# EAGLE schematic MicrophoneSoundModule (EAGLE 6.4)
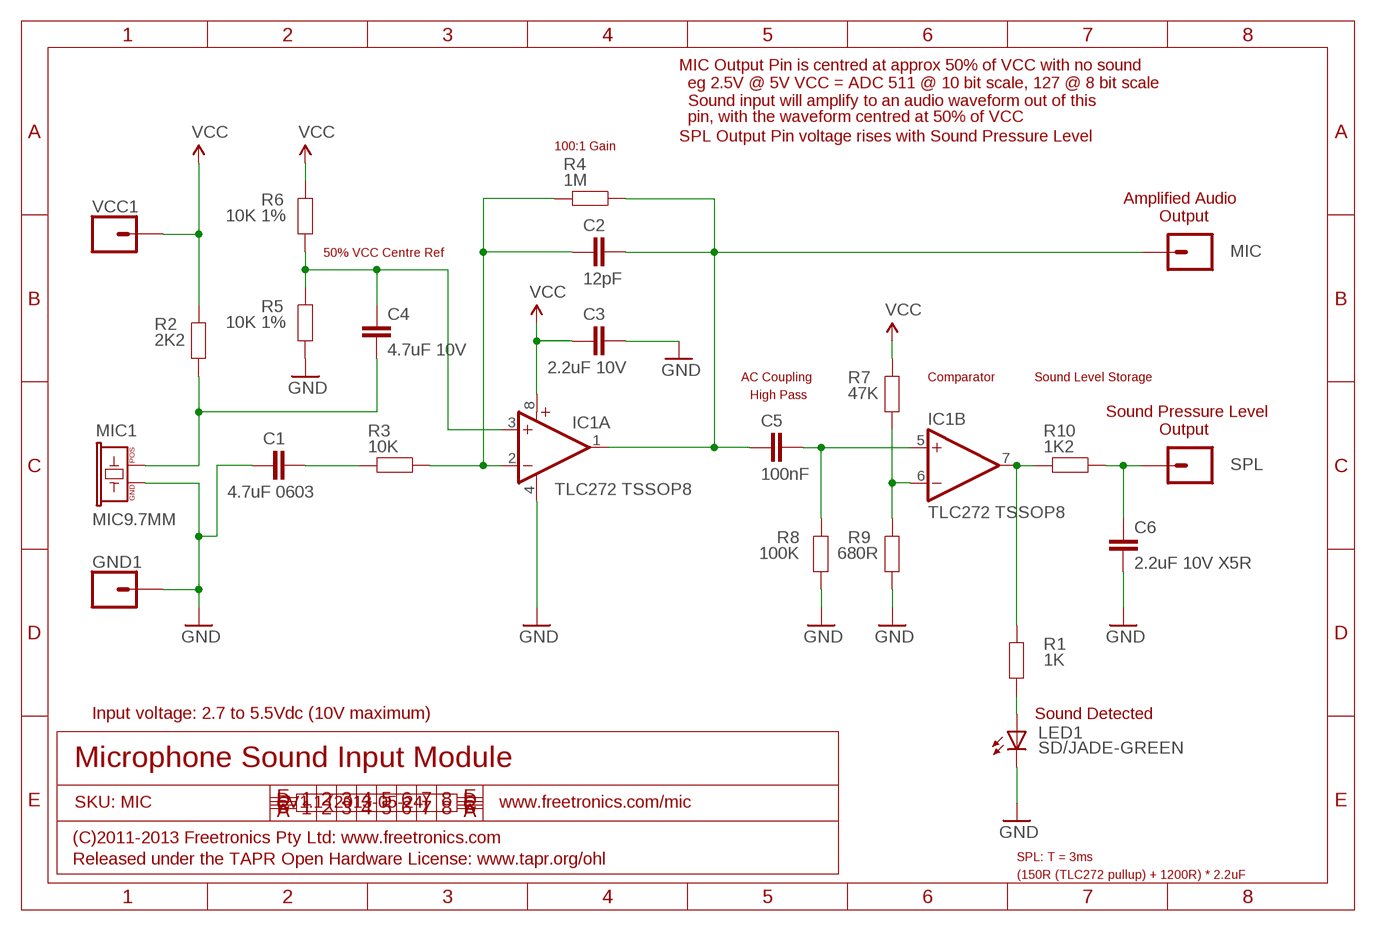
[diagram p0: schematic, sheet 1]

## Parts
C1  4.7uF 0603  CAP0603  [0603]
C2  12pF  CAP0603  [0603]
C3  2.2uF 10V  CAP0603  [0603]
C4  4.7uF 10V  CAP0603  [0603]
C5  100nF  CAP0603  [0603]
C6  2.2uF 10V X5R  CAP0603  [0603]
GND1  M01PTH  [1X01]
IC1  TLC272 TSSOP8  OPAMP-DUALTSSOP8  [TSSOP8]
LED1  SD/JADE-GREEN  LED0603  [LED-0603]
MIC  M01PTH  [1X01]
MIC1  MIC9.7MM  [MIC-9.7MM]
R1  1K  RESISTOR0603  [0603]
R2  2K2  RESISTOR0603  [0603]
R3  10K  RESISTOR0603  [0603]
R4  1M  RESISTOR0603  [0603]
R5  10K 1%  RESISTOR0603  [0603]
R6  10K 1%  RESISTOR0603  [0603]
R7  47K  RESISTOR0603  [0603]
R8  100K  RESISTOR0603  [0603]
R9  680R  RESISTOR0603  [0603]
R10  1K2  RESISTOR0603  [0603]
SPL  M01PTH  [1X01]
VCC1  M01PTH  [1X01]

## Nets
GND: C1.1 C3.2 C6.1 GND1.1 IC1.4(A:V-) LED1.C MIC1.GND R5.1 R8.1 R9.1
N$1: LED1.A R1.1
N$2: C4.1 MIC1.POS R2.1
N$3: C1.2 R3.2
N$4: C2.1 IC1.2(A:-IN) R3.1 R4.2
N$6: C2.2 C5.1 IC1.1(A:OUT) MIC.1 R4.1
N$7: C5.2 IC1.5(B:+IN) R8.2
N$8: C4.2 IC1.3(A:+IN) R5.2 R6.1
N$9: C6.2 R10.1 SPL.1
N$10: IC1.6(B:-IN) R7.1 R9.2
N$11: IC1.7(B:OUT) R1.2 R10.2
VCC: C3.1 IC1.8(A:V+) R2.2 R6.2 R7.2 VCC1.1

## Notes on the sheet
- MIC Output Pin is centred at approx 50% of VCC with no sound
- eg 2.5V @ 5V VCC = ADC 511 @ 10 bit scale, 127 @ 8 bit scale
- Sound input will amplify to an audio waveform out of this
- pin, with the waveform centred at 50% of VCC
- SPL Output Pin voltage rises with Sound Pressure Level
- 100:1 Gain
- Amplified Audio
- Output
- 50% VCC Centre Ref
- AC Coupling | Comparator | Sound Level Storage
- High Pass
- Sound Pressure Level
- Output
- Input voltage: 2.7 to 5.5Vdc (10V maximum) | Sound Detected
- Microphone Sound Input Module
- SKU: MIC | V1.1 (2013-05-24) | www.freetronics.com/mic
- (C)2011-2013 Freetronics Pty Ltd: www.freetronics.com
- SPL: T = 3ms
- Released under the TAPR Open Hardware License: www.tapr.org/ohl
- (150R (TLC272 pullup) + 1200R) * 2.2uF

## Library data of the parts
C1-C6 = freetronics-master-v1:CAP: Capacitor Standard 0603 ceramic capacitor, and 0.1" leaded capacitor.
GND1 MIC SPL VCC1 = freetronics-master-v1:M01: Header 1 Standard 1-pin 0.1" header. Use with straight break away headers (SKU : PRT-00116), right angle break away headers (PRT-00553), swiss pins (PRT-00743), machine pins (PRT-00117), and female headers (PRT-00115).
IC1 = freetronics-master-v1:OPAMP-DUAL: Operational Amplifier
LED1 = freetronics-marc:LED: LEDs Standard schematic elements and footprints for 5mm, 3mm, 1206, and 0603 sized LEDs. 5mm - Spark Fun Electronics SKU : COM-00529 (and others)
MIC1 = freetronics-master-v1:MIC: Microphone Omni-directional electret microphone. 9.7mm standard diameter.
R1-R10 = freetronics-master-v1:RESISTOR: Resistor Basic schematic elements and footprints for 0603, 1206, and PTH 1/10th watt (small) resistors.